# Altium schematic sheet POW.SchDoc
size A4; SheetNumber: 1; SheetTotal: 6
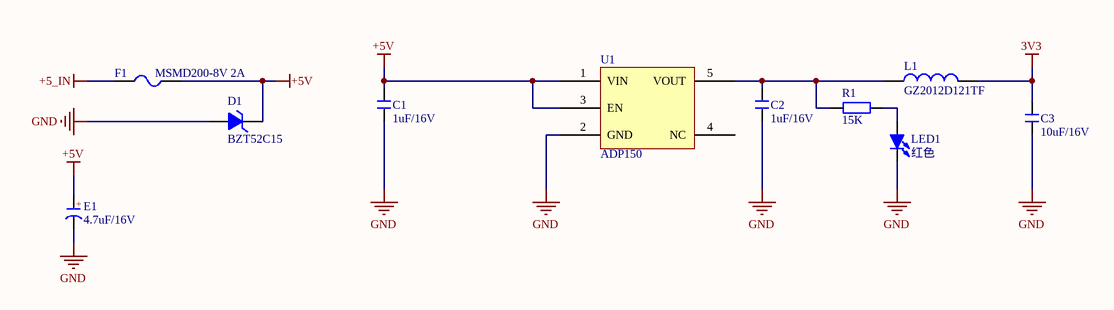
[diagram p0: POW.SchDoc]

## Parts
C1  1uF/16V  [C 0402_L]
C2  1uF/16V  [C 0402_L]
C3  10uF/16V  [C 0603_L]
D1  BZT52C15  [SOD-123]
E1  4.7uF/16V  [CD A(3216)]
F1  MSMD200-8V 2A  [FU 0603]
L1  GZ2012D121TF  [L 0805]
LED1  红色  [LED]
R1  15K  [R 0402_L]
U1  ADP150  [SOT23-5]

## Nets
3V3: C3.2 L1.2
+5_IN: F1.1
+5V: C1.2 D1.2(K) E1.1(A) F1.2 U1.1(VIN) U1.3(EN)
GND: C1.1 C2.1 C3.1 D1.1(A) E1.2(K) LED1.2(K) U1.2(GND)
NetC2_2: C2.2 L1.1 R1.1 U1.5(VOUT)
NetLED1_1: LED1.1(A) R1.2

Not connected (* = marked no-connect by the designer): U1 4(NC)

## Notes on the sheet
- (in symbol C-CD) +

## Library data of the parts
C1 C2 = C: 贴片电容; 主类型: 电容; 值精度: ±10%; 元件封装: 0402; 具体类型: 陶瓷电容; 封装类型: 贴片; 温度漂移: X5R; 生产商: SAMSUNG(三星); 生产商零件编码: CL05A105KO5NNNC; 值/型号: 1uF/16V; 立创编号: C29266
C3 = C: 贴片电容; 主类型: 电容; 值精度: ±10%; 元件封装: 0603; 具体类型: 陶瓷电容; 封装类型: 贴片; 温度漂移: X5R; 生产商: SAMSUNG(三星); 生产商零件编码: CL10A106MO8NQNC; 值/型号: 10uF/16V; 立创编号: C92487
D1 = IN4735A: 主类型: 二极管; 具体类型: 稳压二极管; 封装类型: 贴片; 生产商: MDD; 值/型号: BZT52C15; 元件封装: SOD-123; 生产商零件编码: BZT52C15; 立创编号: C173427
E1 = C-CD: 聚合物电容 4.7uF/16V; 主类型: 电容; 值精度: ±20%; 元件封装: CASE-A_3216; 封装类型: 贴片; 温度范围: -55℃ ~ +105℃; 生产商: Sunlord(顺络); 生产商零件编码: TC211A475M016A; 值/型号: 4.7uF/16V; 具体类型: 聚合物电容; 立创编号: C136628
F1 = FU: 贴片保险丝; 版权归属: 源创客; BOM名称: 贴片保险丝; 学习资源: www.ooocke.com
L1 = L: 小功率贴片电感; 主类型: 电感; 生产商: Sunlord(顺络); 值/型号: GZ2012D121TF; 生产商零件编码: GZ2012D121TF; 立创编号: C38480
LED1 = LED-SMD: C84267
R1 = R: 贴片电阻 0402 5%; 主类型: 电阻; 值精度: ±1%; 元件封装: 0402; 封装类型: 贴片; 温度漂移: 50ppm; 生产商: 国巨; 生产商零件编码: RT0402FRE0715KL; 值/型号: 15K; 具体类型: 贴片电阻; 立创编号: C136975
U1 = ADP150: ADP150AUJZ-3.3-R7; 主类型: 电源芯片; 元件封装: SOT-23-5; 具体类型: 线性稳压芯片; 封装类型: 贴片; 生产商: ADI(亚德诺)/LINEAR; 值/型号: ADP150AUJZ-3.3-R7; 生产商零件编码: ADP150AUJZ-3.3-R7; 立创编号: C29149